# EAGLE design ATTINY13aDogStairs (EAGLE 5.06)
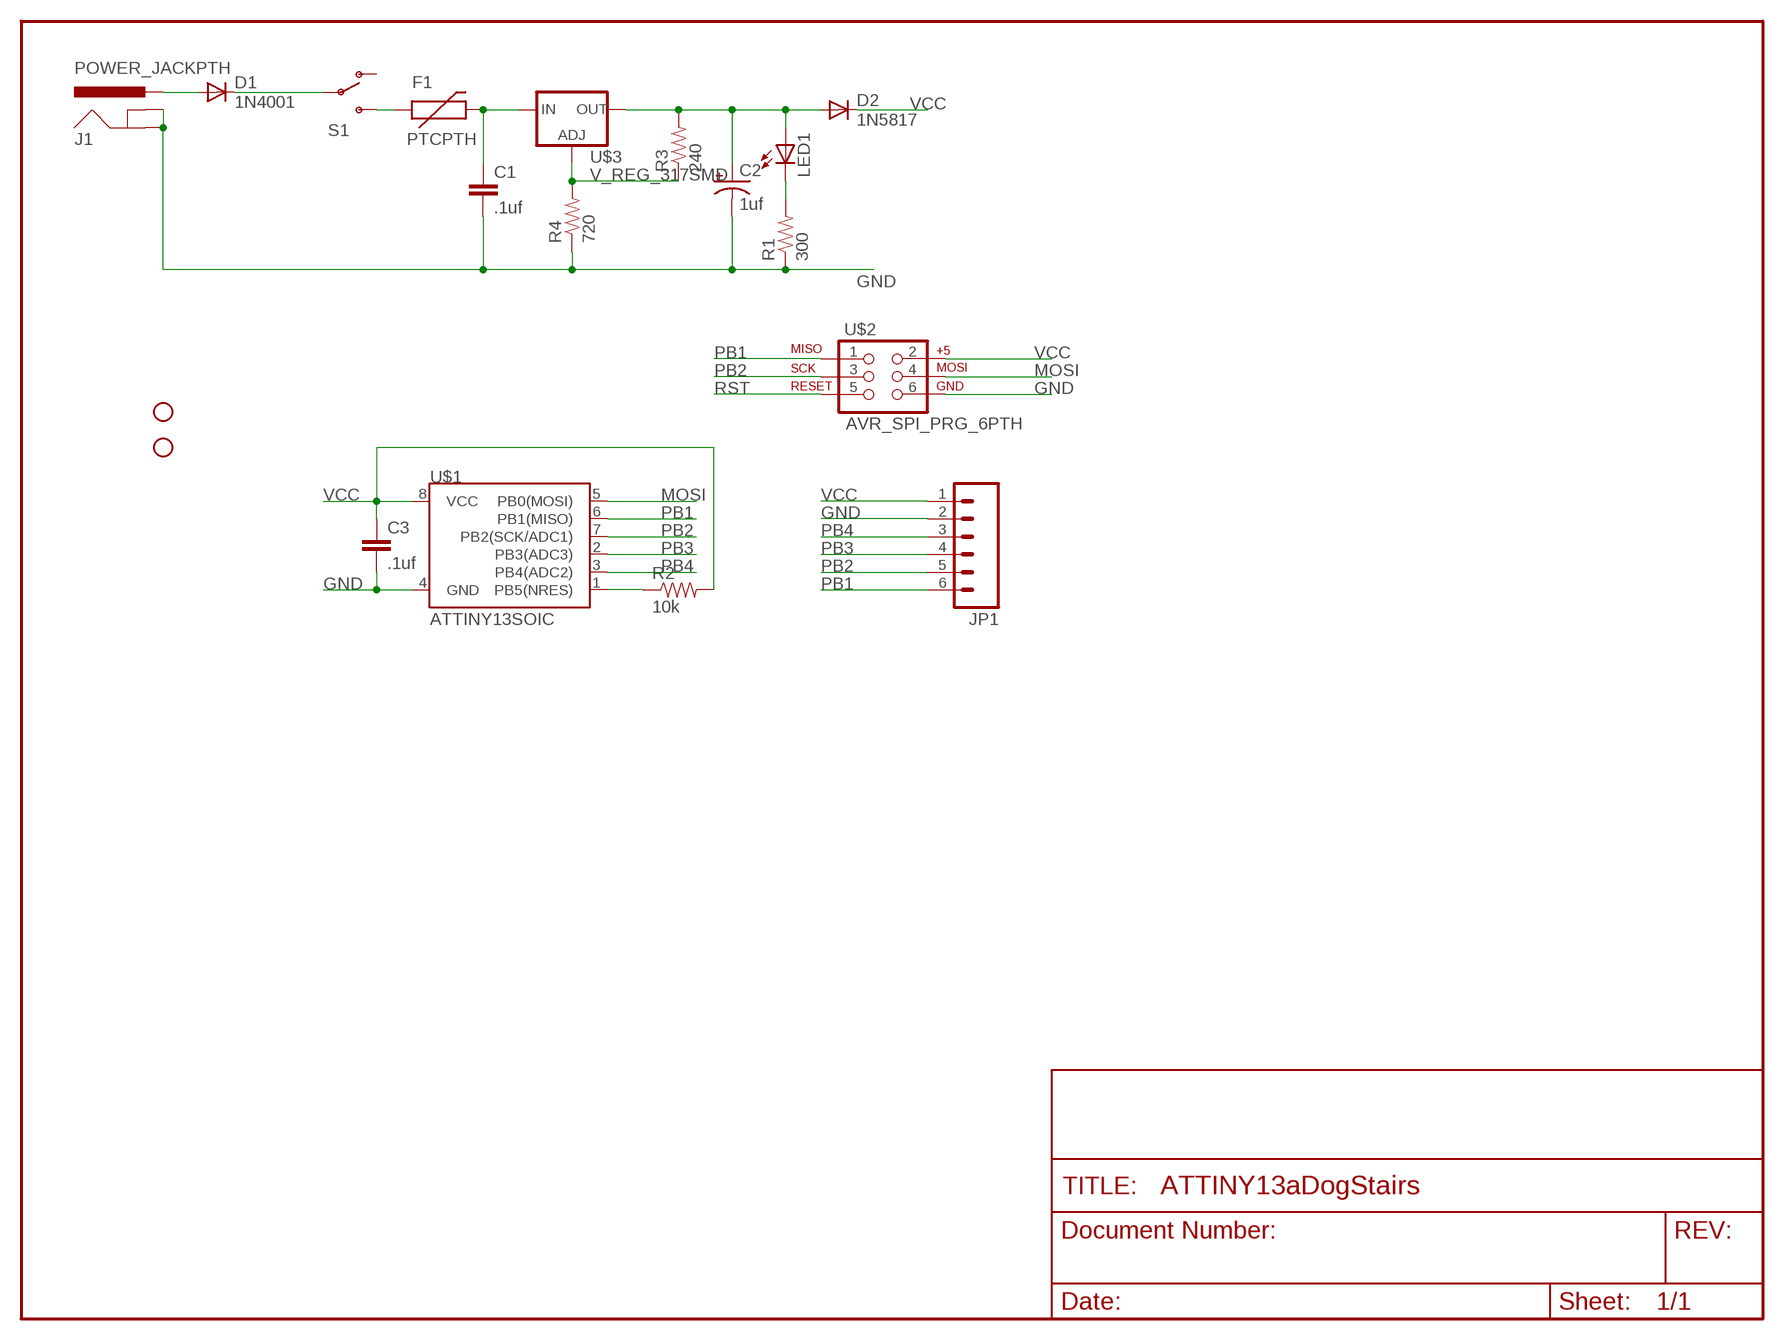
[diagram p0: schematic, sheet 1]

## Parts
C1  .1uf  CAP0603-CAP  [0603-CAP]
C2  1uf  CAP_POL1206  [EIA3216]
C3  .1uf  CAP0603-CAP  [0603-CAP]
D1  1N4001  DIODEPTH  [DIODE-1N4001]
D2  1N5817  DIODE1N4148  [DIODE-1N4148]
F1  PTCPTH  [PTC]
J1  POWER_JACKPTH  [POWER_JACK_PTH]
JP1  M06SIP  [1X06]
JP4  STAND-OFF  [STAND-OFF]
JP5  STAND-OFF  [STAND-OFF]
LED1  LED0603  [LED-0603]
R1  300  RESISTOR  [0805]
R2  10k  RESISTOR  [0805]
R3  240  RESISTOR  [0805]
R4  720  RESISTOR  [0805]
S1  SWITCH-SPSTPTH  [SWITCH-SPDT]
U$1  ATTINY13SOIC  [SO08]
U$2  AVR_SPI_PRG_6PTH  [2X3]
U$3  V_REG_317SMD  [SOT223]

## Nets
GND: C1.2 C2.C(-) C3.2 J1.GND J1.GNDBREAK JP1.2 R1.1 R4.1 U$1.4(GND) U$2.6
MOSI: U$1.5(PB0(MOSI)) U$2.4
N$1: D1.A J1.PWR
N$2: D1.C S1.2(P)
N$3: C2.A(+) D2.A LED1.A R3.2 U$3.2(OUT)
N$4: F1.P$1 S1.3(S)
N$5: C1.1 F1.P$2 U$3.3(IN)
N$6: R3.1 R4.2 U$3.1(ADJ)
N$9: LED1.C R1.2
PB1: JP1.6 U$1.6(PB1(MISO)) U$2.1
PB2: JP1.5 U$1.7(PB2(SCK/ADC1)) U$2.3
PB3: JP1.4 U$1.2(PB3(ADC3))
PB4: JP1.3 U$1.3(PB4(ADC2))
RST: R2.1 U$1.1(PB5(NRES)) U$2.5
VCC: C3.1 D2.C JP1.1 R2.2 U$1.8(VCC) U$2.2
Unconnected: S1.1(O)

## Library data of the parts
C1 C3 = SparkFun:CAP: Capacitor Standard 0603 ceramic capacitor, and 0.1" leaded capacitor.
C2 = SparkFun:CAP_POL: Capacitor Polarized These are standard SMD and PTH capacitors. Normally 10uF, 47uF, and 100uF in electrolytic and tantalum varieties. Always verify the external diameter of the through hole cap, it varies with capacity, voltage, and manufacturer. The EIA devices should be standard.
D1 D2 = SparkFun:DIODE: Diode These are standard reverse protection diodes and small signal diodes. SMA package can handle up to about 1A. SOD-323 can handle about 200mA. What the SOD-323 package when ordering, there are some mfgs out there that are 5-pin packages.
F1 = SparkFun:PTC: Resettable Fuse PTC Resettable Fuse. Spark Fun Electronics SKU : COM-08357
J1 = SparkFun:POWER_JACK: Power Jack This is the standard 5.5mm barrel jack for power. The PTH is the most common, proven, reliable, footprint. All others are experimental. The Slot footprint only works if the mill layer is transmitted to the PCB fab house so be warned. Spark Fun Electronics SKU : PRT-00119. Mating wall wart : TOL-00298 (and others)
JP1 = SparkFun:M06: Header 6 Standard 6-pin 0.1" header. Use with straight break away headers (SKU : PRT-00116), right angle break away headers (PRT-00553), swiss pins (PRT-00743), machine pins (PRT-00117), and female headers (PRT-00115). Molex polarized connector foot print use with SKU : PRT-08094 with associated crimp pins and housings. NOTES ON THE VARIANTS LOCK and LOCK_LONGPADS... This footprint was designed to help hold the alignment of a through-hole component (i.e. 6-pin header) while soldering it into place. You may notice that each hole has been shifted either up or down by 0.005 of an inch from it's more standard position (which is a perfectly straight line). This slight alteration caused the pins (the squares in the middle) to touch the edges of the holes. Because they are alternating, it causes a "brace" to hold the component in place. 0.005 has proven to be the perfect amount of "off-center" position when using our standard breakaway headers. Although looks a little odd when you look at the bare footprint, once you have a header in there, the alteration is very hard to notice. Also, if you push a header all the way into place, it is covered up entirely on the bottom side. This idea of altering the position of holes to aid alignment will be further integrated into the Sparkfun Library for other footprints. It can help hold any component with 3 or more connection pins.
JP4 JP5 = SparkFun:STAND-OFF: Stand Off This is the mechanical footprint for a #4 phillips button head screw. Use the keepout ring to avoid running the screw head into surrounding components. SKU : PRT-00447
LED1 = SparkFun:LED: LEDs Standard schematic elements and footprints for 5mm, 3mm, 1206, and 0603 sized LEDs. 5mm - Spark Fun Electronics SKU : COM-00529 (and others)
R1-R4 = SparkFun:RESISTOR: Resistor Basic schematic elements and footprints for 0603, 1206, and PTH 1/10th watt (small) resistors.
S1 = SparkFun:SWITCH-SPST: SPST Switch Simple slide switch. Spark Fun Electronics SKU : COM-00102
U$1 = SparkFun:ATTINY13
U$2 = SparkFun:AVR_SPI_PRG_6: AVR ISP 6 Pin This is the reduced ISP connector for AVR programming. Common on Arduino. This footprint will take up less PCB space and can be used with a 10-pin to 6-pin adapter such as SKU: BOB-08508
U$3 = SparkFun:V_REG_317: Voltage Regulator Standard LM317 adjustable voltage regulator. AOI (Adjust Output Input). Google 'LM317 Calculator' for easy to use app to get the two resistor values needed. 240/720 for 5V output. 240/390 for 3.3V output. Spark Fun Electronics SKU : COM-00527

## Board
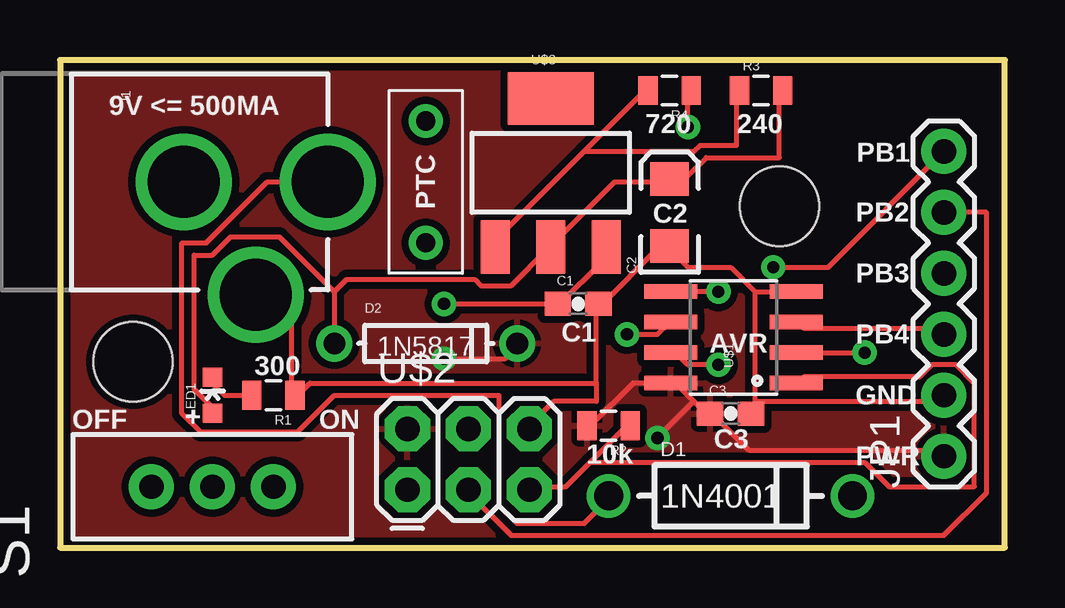
[diagram p1: board, top side]
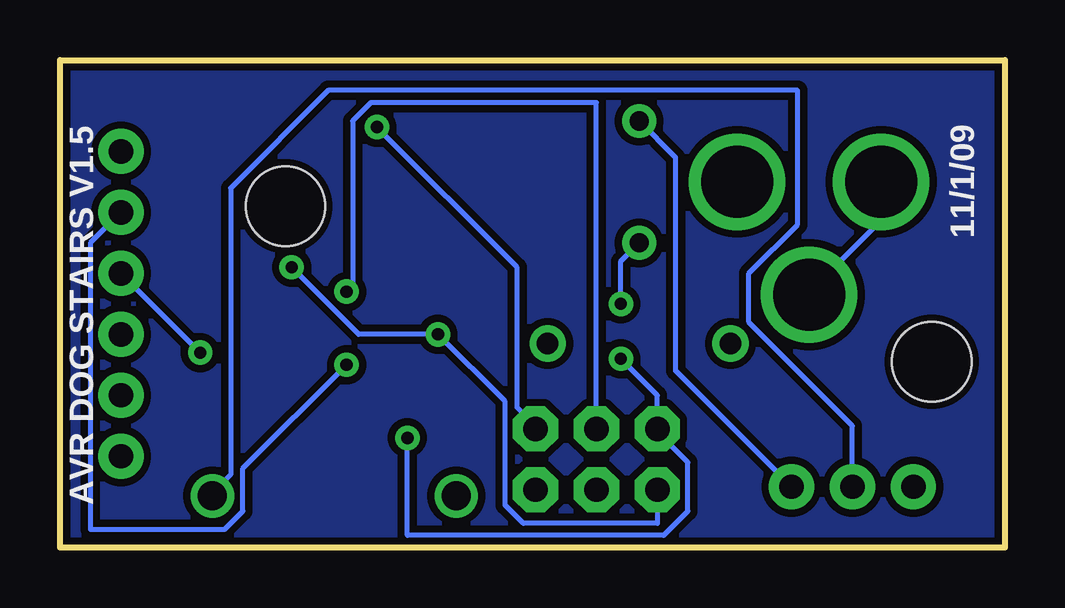
[diagram p2: board, bottom side, seen from below]

Size 39.37 x 20.32 mm. Coordinates in mm from the lower left corner, seen from the top.
Outline: 0,0 39.37,0 39.37,20.32 0,20.32 0,0
Copper layers (1*16): Top 0.035mm / dielectric 1.5mm / Bottom 0.035mm
Design rules "SparkFun": minimum track width 8mil, minimum drill 20mil, track to track 8mil, track to pad 8mil, pad to pad 8mil, via to via 8mil, smd to smd 8mil, copper to edge 10mil, drill to drill 8mil, minimum pad ring 12mil, minimum via ring 10mil, stop-mask expansion 4mil, vias tented up to drill 25mil, thermal gap 10mil

### Footprints (pad centres in the part's own frame; a part is rotated, then mirrored left to right if it is on the bottom)
0603-CAP = smd 1.1 x 1: 1 -0.85,0; 2 0.85,0
EIA3216 = smd 1.4 x 1.6: A 1.4,0; C -1.4,0
DIODE-1N4001 = drill 1.2 round: A -5.08,0; C 5.08,0
DIODE-1N4148 = drill 0.9 round: A -3.81,0; C 3.81,0
PTC = drill 0.8 round: P$1 -2.54,0; P$2 2.54,0
POWER_JACK_PTH = drill 2.997 round: GND 0,7.7; GNDBREAK 4.7,10.7; PWR 0,13.7
1X06 = drill 1.016 pad 1.88 round: 1 0,0; 2 2.54,0; 3 5.08,0; 4 7.62,0; 5 10.16,0; 6 12.7,0
STAND-OFF = hole 3.302: 0,0
LED-0603 = smd 0.8 x 0.8: A 0,-0.75; C 0,0.75
0805 = smd 0.8 x 1.2: 1 -0.9,0; 2 0.9,0
SWITCH-SPDT = drill 1.016 pad 1.88 round: 1 0,2.54; 2 0,0; 3 0,-2.54
SO08 = smd 0.61 x 2.21: 1 -1.905,-2.616; 2 -0.635,-2.616; 3 0.635,-2.616; 4 1.905,-2.616; 5 1.905,2.616; 6 0.635,2.616; 7 -0.635,2.616; 8 -1.905,2.616
2X3 = drill 1.016 pad 1.88 octagon: 1 0,0; 2 0,2.54; 3 2.54,0; 4 2.54,2.54; 5 5.08,0; 6 5.08,2.54
SOT223 = smd 1.219 x 2.235: 1 -2.311,-3.099; 2 0,-3.099; 3 2.311,-3.099 | smd 3.6 x 2.2: 4 0,3.099

### Placement (x,y rotation side)
C1  21.59,10.16 0 top
C2  25.4,13.97 90 top
C3  27.94,5.59 0 top
D1  27.94,2.16 0 top
D2  15.24,8.51 0 top
F1  15.24,15.24 270 top
J1  -2.54,15.24 270 top
JP1  36.83,3.81 90 top
JP4  3.05,7.75 0 top
JP5  29.97,14.22 0 top
LED1  6.35,6.35 0 top
R1  8.89,6.35 180 top
R2  22.86,5.08 180 top
R3  29.21,19.05 0 top
R4  25.4,19.05 180 top
S1  6.35,2.54 90 top
U$1  28.07,8.76 90 top
U$2  14.48,2.41 0 top
U$3  20.45,15.62 0 top

### Tracks (layer width: path | path; a pad name or v marks a point on that pad's centre or on a via)
GND  (via drill 0.51)
  Top 0.203: J1.GNDBREAK 8.38,10.41 9.65,10.41 9.65,6.35 R1.1 9.91,6.35 10.41,6.86 22.35,6.86 | 25.4,12.45 24.89,12.45 22.61,10.16 C1.2 22.35,10.16 22.35,6.86 | 28.96,10.67 28.96,6.1 | 28.96,6.1 28.96,5.59 C3.2 | 28.96,10.67 U$1.4 | 25.4,12.45 26.16,11.68 27.94,11.68 28.96,10.67 | 25.4,12.45 C2.C | JP1.2 36.58,6.1 28.96,6.1 | v26.16,17.53 26.16,19.05 R4.1 | 22.35,6.86 22.35,6.1 20.57,6.1 19.56,5.08 U$2.6
  Bottom 0.203: J1.GNDBREAK 8.13,10.67 5.33,13.46 5.33,15.24 J1.GND | v26.16,17.53 20.32,11.68 20.32,5.84 19.56,5.08 U$2.6
MOSI  (via drill 0.51)
  Top 0.203: v27.43,10.67 U$1.5
  Bottom 0.203: v27.43,10.67 27.18,10.92 27.18,17.78 26.42,18.54 17.02,18.54 U$2.4
N$1
  Top 0.203: D1.A 22.86,2.03 21.84,1.02 19.05,1.02 18.29,1.78 18.29,6.35 11.43,6.35 9.91,4.83 5.84,4.83 5.08,5.59 5.08,12.7 6.1,12.7 8.64,15.24 J1.PWR
N$2
  Bottom 0.203: S1.2 6.35,5.08 10.67,9.4 10.67,11.43 8.64,13.46 8.64,19.05 28.19,19.05 32.26,14.99 32.26,3.05 33.02,2.29 D1.C
N$3
  Top 0.203: 11.43,10.67 9.14,12.95 7.11,12.95 6.35,12.19 5.59,12.19 5.59,6.6 6.35,5.84 LED1.A | 11.43,10.67 D2.A | R3.2 29.97,19.05 29.97,16.26 26.92,16.26 26.16,15.49 25.4,15.49 C2.A 25.4,15.24 23.11,15.24 20.57,12.7 U$3.2 20.32,12.45 18.8,10.92 17.53,10.92 17.27,11.18 11.94,11.18 11.43,10.67
N$4
  Bottom 0.203: F1.P$1 13.72,16.26 13.72,7.37 S1.3
N$5  (via drill 0.51)
  Top 0.203: U$3.3 22.61,12.45 22.61,11.94 20.83,10.16 C1.1 v16,10.16
  Bottom 0.203: F1.P$2 16,11.94 v16,10.16
N$6
  Top 0.203: 21.84,16.51 18.03,12.7 U$3.1 | 21.84,16.51 24.38,19.05 R4.2 | 21.84,16.51 26.42,16.51 26.67,16.76 28.19,16.76 28.19,19.05 R3.1
N$8
  pour Bottom (isolate 0.305): 0,20.32 0,0 39.37,0 39.37,20.32
N$9
  Top 0.203: LED1.C 6.35,6.86 6.86,6.35 R1.2
PB1  (via drill 0.51)
  Top 0.203: v23.62,8.89 24.89,8.89 25.4,9.4 U$1.6 | JP1.6 32,11.68 v29.72,11.68
  Bottom 0.203: U$2.1 14.48,1.02 20.07,1.02 20.83,1.78 20.83,6.1 v23.62,8.89 26.92,8.89 v29.72,11.68
PB2  (via drill 0.51)
  Top 0.203: v27.43,7.62 26.16,7.62 25.65,8.13 U$1.7 | JP1.5 38.61,13.97 38.61,2.29 36.83,0.51 18.8,0.51 17.02,2.29 U$2.3
  Bottom 0.203: v27.43,7.62 31.75,3.3 31.75,1.52 32.51,0.76 38.1,0.76 38.1,12.7 JP1.5
PB3  (via drill 0.51)
  Top 0.203: U$1.2 v33.53,8.13
  Bottom 0.203: v33.53,8.13 JP1.4
PB4
  Top 0.203: JP1.3 36.58,9.14 30.99,9.14 30.73,9.4 U$1.3
RST
  Top 0.203: 22.1,3.56 21.08,2.54 19.56,2.54 U$2.5 | 22.1,3.56 23.62,5.08 R2.1 | 22.1,3.56 33.53,3.56 34.54,2.54 38.1,2.54 38.1,6.86 37.34,7.62 36.32,7.62 35.81,7.11 30.99,7.11 30.73,6.86 U$1.1
VCC  (via drill 0.51)
  Top 0.203: v16,7.87 18.54,7.87 19.05,8.38 D2.C | 26.42,6.1 25.65,6.86 U$1.8 23.88,6.86 22.1,5.08 R2.2 | 26.42,6.1 26.92,5.59 C3.1 27.18,5.59 28.7,4.06 36.58,4.06 JP1.1 | v24.89,4.57 26.42,6.1
  Bottom 0.203: v16,7.87 14.48,6.35 U$2.2 14.48,4.83 13.21,3.56 13.21,1.52 14.22,0.51 24.89,0.51 v24.89,4.57
  pour Top (isolate 0.305): 0,20.32 0,0 39.37,0 39.37,20.32

### Text on the board
tPlace: 9V <= 500MA | 720 | 240 | PB1 | PTC | C2 | PB2 | PB3 | C1 | PB4 | 300 | AVR | GND | OFF | + | ON | C3 | 10k | PWR
bPlace: 11/1/09 | AVR DOG STAIRS V1.5